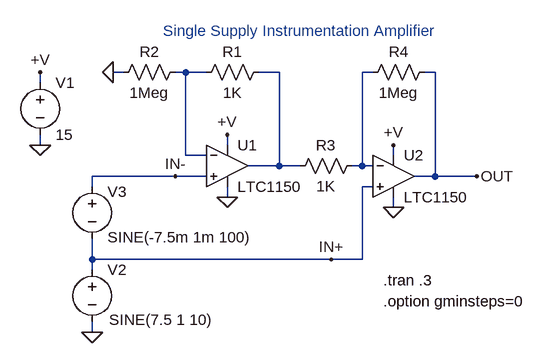
[diagram p0: schematic 1150.asc]
1150.asc, the LTspice schematic file:
Version 4
SHEET 1 896 680
WIRE 32 96 16 96
WIRE 128 96 112 96
WIRE 160 96 128 96
WIRE 272 96 240 96
WIRE 416 96 400 96
WIRE 512 96 496 96
WIRE -96 112 -96 96
WIRE -96 208 -96 192
WIRE 192 208 192 192
WIRE 128 224 128 96
WIRE 160 224 128 224
WIRE 448 224 448 208
WIRE 272 240 272 96
WIRE 272 240 224 240
WIRE 304 240 272 240
WIRE 400 240 400 96
WIRE 400 240 384 240
WIRE 416 240 400 240
WIRE 112 256 -16 256
WIRE 160 256 112 256
WIRE 512 256 512 96
WIRE 512 256 480 256
WIRE 576 256 512 256
WIRE -16 272 -16 256
WIRE 416 272 400 272
WIRE 192 288 192 272
WIRE 448 304 448 288
WIRE -16 384 -16 352
WIRE 352 384 -16 384
WIRE 400 384 400 272
WIRE 400 384 352 384
WIRE -16 400 -16 384
WIRE -16 496 -16 480
FLAG -96 208 0
FLAG 192 192 +V
FLAG -96 96 +V
FLAG 16 96 0
FLAG -16 496 0
FLAG 448 208 +V
FLAG 576 256 OUT
FLAG 192 288 0
FLAG 448 304 0
FLAG 112 256 IN-
FLAG 352 384 IN+
SYMBOL voltage -96 96 R0
SYMATTR InstName V1
SYMATTR Value 15
SYMBOL res 256 80 R90
WINDOW 0 0 56 VBottom 0
WINDOW 3 32 56 VTop 0
SYMATTR InstName R1
SYMATTR Value 1K
SYMBOL res 128 80 R90
WINDOW 0 0 56 VBottom 0
WINDOW 3 32 56 VTop 0
SYMATTR InstName R2
SYMATTR Value 1Meg
SYMBOL voltage -16 256 R0
WINDOW 0 24 24 Left 0
WINDOW 3 24 94 Left 0
SYMATTR InstName V3
SYMATTR Value SINE(-7.5m 1m 100)
SYMBOL res 400 224 R90
WINDOW 0 0 56 VBottom 0
WINDOW 3 32 56 VTop 0
SYMATTR InstName R3
SYMATTR Value 1K
SYMBOL res 512 80 R90
WINDOW 0 0 56 VBottom 0
WINDOW 3 32 56 VTop 0
SYMATTR InstName R4
SYMATTR Value 1Meg
SYMBOL voltage -16 384 R0
WINDOW 3 26 93 Left 0
SYMATTR Value SINE(7.5 1 10)
SYMATTR InstName V2
SYMBOL opamps\\LTC1150 192 176 R0
SYMATTR InstName U1
SYMBOL opamps\\LTC1150 448 192 R0
SYMATTR InstName U2
TEXT 432 416 Left 0 !.tran .3
TEXT 432 448 Left 0 !.option gminsteps=0
TEXT 304 48 Bottom 0 ;Single Supply Instrumentation Amplifier

The netlist it stands for:
* 1150.asc
V1 +V 0 15
R1 N002 N001 1K
R2 N001 0 1Meg
V3 IN- IN+ SINE(-7.5m 1m 100)
R3 N003 N002 1K
R4 OUT N003 1Meg
V2 IN+ 0 SINE(7.5 1 10)
XU1 IN- N001 +V 0 N002 LTC1150  ; pins In+ In- V+ V- OUT
XU2 IN+ N003 +V 0 OUT LTC1150  ; pins In+ In- V+ V- OUT
.tran .3
.option gminsteps=0
* Single Supply Instrumentation Amplifier
.lib LTC.lib
.backanno
.end